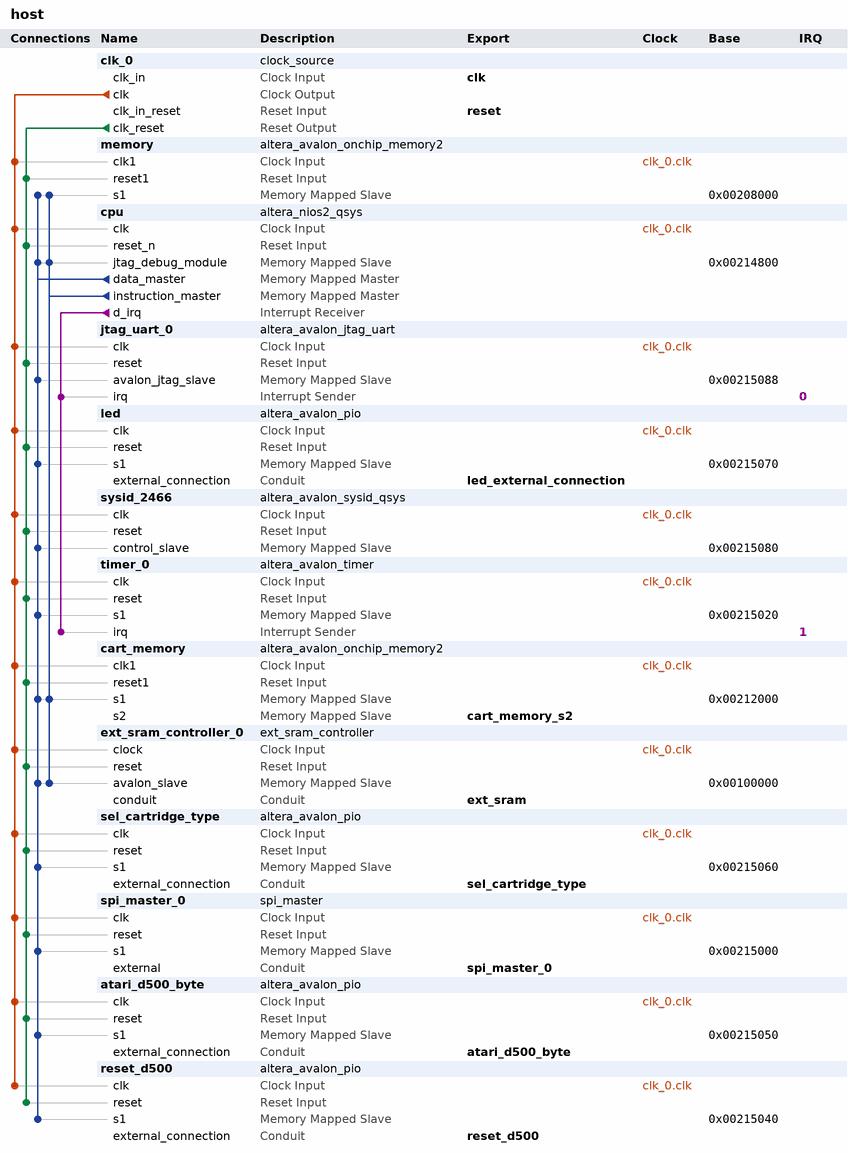
[diagram p0: system contents]
# Platform Designer (Qsys) system host, MAX 10 10M08SAE144C8GES
# Parameters at their usual value, and those the tool derives, are not listed.
package require -exact qsys 14.1
create_system host
set_project_property DEVICE_FAMILY {MAX 10}
set_project_property DEVICE 10M08SAE144C8GES

add_instance clk_0 clock_source 14.1
set_instance_parameter_value clk_0 clockFrequency 50000000

add_instance memory altera_avalon_onchip_memory2 14.1
set_instance_parameter_value memory dataWidth 32
set_instance_parameter_value memory dualPort false
set_instance_parameter_value memory initMemContent true
set_instance_parameter_value memory initializationFileName onchip_mem.hex
set_instance_parameter_value memory memorySize 28672

add_instance cpu altera_nios2_qsys 14.1
set_instance_parameter_value cpu breakSlave cpu.jtag_debug_module
set_instance_parameter_value cpu exceptionSlave memory.s1
set_instance_parameter_value cpu icache_size 4096
set_instance_parameter_value cpu impl Tiny
set_instance_parameter_value cpu mmu_TLBMissExcSlave None
set_instance_parameter_value cpu muldiv_multiplierType DSPBlock
set_instance_parameter_value cpu resetSlave memory.s1
set_instance_parameter_value cpu resetrequest_enabled true

add_instance jtag_uart_0 altera_avalon_jtag_uart 14.1
set_instance_parameter_value jtag_uart_0 simInteractiveOptions NO_INTERACTIVE_WINDOWS

add_instance led altera_avalon_pio 14.1
set_instance_parameter_value led direction Output
set_instance_parameter_value led width 5

add_instance sysid_2466 altera_avalon_sysid_qsys 14.1
set_instance_parameter_value sysid_2466 id 9318

add_instance timer_0 altera_avalon_timer 14.1
set_instance_parameter_value timer_0 period 1
set_instance_parameter_value timer_0 periodUnits MSEC

add_instance cart_memory altera_avalon_onchip_memory2 14.1
set_instance_parameter_value cart_memory dataWidth 8
set_instance_parameter_value cart_memory dualPort true
set_instance_parameter_value cart_memory initMemContent true
set_instance_parameter_value cart_memory initializationFileName boot_rom.hex
set_instance_parameter_value cart_memory memorySize 8192
set_instance_parameter_value cart_memory singleClockOperation true
set_instance_parameter_value cart_memory useNonDefaultInitFile true

add_instance ext_sram_controller_0 ext_sram_controller 1.0

add_instance sel_cartridge_type altera_avalon_pio 14.1
set_instance_parameter_value sel_cartridge_type direction Output
set_instance_parameter_value sel_cartridge_type width 8

add_instance spi_master_0 spi_master 1.3

add_instance atari_d500_byte altera_avalon_pio 14.1
set_instance_parameter_value atari_d500_byte direction Input
set_instance_parameter_value atari_d500_byte width 8

add_instance reset_d500 altera_avalon_pio 14.1
set_instance_parameter_value reset_d500 direction Output
set_instance_parameter_value reset_d500 width 1

# connections
add_connection clk_0.clk atari_d500_byte.clk clock
add_connection clk_0.clk cart_memory.clk1 clock
add_connection clk_0.clk cpu.clk clock
add_connection clk_0.clk ext_sram_controller_0.clock clock
add_connection clk_0.clk jtag_uart_0.clk clock
add_connection clk_0.clk led.clk clock
add_connection clk_0.clk memory.clk1 clock
add_connection clk_0.clk reset_d500.clk clock
add_connection clk_0.clk sel_cartridge_type.clk clock
add_connection clk_0.clk spi_master_0.clk clock
add_connection clk_0.clk sysid_2466.clk clock
add_connection clk_0.clk timer_0.clk clock
add_connection clk_0.clk_reset atari_d500_byte.reset reset
add_connection clk_0.clk_reset cart_memory.reset1 reset
add_connection clk_0.clk_reset cpu.reset_n reset
add_connection clk_0.clk_reset ext_sram_controller_0.reset reset
add_connection clk_0.clk_reset jtag_uart_0.reset reset
add_connection clk_0.clk_reset led.reset reset
add_connection clk_0.clk_reset memory.reset1 reset
add_connection clk_0.clk_reset reset_d500.reset reset
add_connection clk_0.clk_reset sel_cartridge_type.reset reset
add_connection clk_0.clk_reset spi_master_0.reset reset
add_connection clk_0.clk_reset sysid_2466.reset reset
add_connection clk_0.clk_reset timer_0.reset reset
add_connection cpu.data_master atari_d500_byte.s1 avalon
set_connection_parameter_value cpu.data_master/atari_d500_byte.s1 baseAddress 0x00215050
add_connection cpu.data_master cart_memory.s1 avalon
set_connection_parameter_value cpu.data_master/cart_memory.s1 baseAddress 0x00212000
add_connection cpu.data_master cpu.jtag_debug_module avalon
set_connection_parameter_value cpu.data_master/cpu.jtag_debug_module baseAddress 0x00214800
add_connection cpu.data_master ext_sram_controller_0.avalon_slave avalon
set_connection_parameter_value cpu.data_master/ext_sram_controller_0.avalon_slave baseAddress 0x00100000
add_connection cpu.data_master jtag_uart_0.avalon_jtag_slave avalon
set_connection_parameter_value cpu.data_master/jtag_uart_0.avalon_jtag_slave baseAddress 0x00215088
add_connection cpu.data_master led.s1 avalon
set_connection_parameter_value cpu.data_master/led.s1 baseAddress 0x00215070
add_connection cpu.data_master memory.s1 avalon
set_connection_parameter_value cpu.data_master/memory.s1 baseAddress 0x00208000
add_connection cpu.data_master reset_d500.s1 avalon
set_connection_parameter_value cpu.data_master/reset_d500.s1 baseAddress 0x00215040
add_connection cpu.data_master sel_cartridge_type.s1 avalon
set_connection_parameter_value cpu.data_master/sel_cartridge_type.s1 baseAddress 0x00215060
add_connection cpu.data_master spi_master_0.s1 avalon
set_connection_parameter_value cpu.data_master/spi_master_0.s1 baseAddress 0x00215000
add_connection cpu.data_master sysid_2466.control_slave avalon
set_connection_parameter_value cpu.data_master/sysid_2466.control_slave baseAddress 0x00215080
add_connection cpu.data_master timer_0.s1 avalon
set_connection_parameter_value cpu.data_master/timer_0.s1 baseAddress 0x00215020
add_connection cpu.instruction_master cart_memory.s1 avalon
set_connection_parameter_value cpu.instruction_master/cart_memory.s1 baseAddress 0x00212000
add_connection cpu.instruction_master cpu.jtag_debug_module avalon
set_connection_parameter_value cpu.instruction_master/cpu.jtag_debug_module baseAddress 0x00214800
add_connection cpu.instruction_master ext_sram_controller_0.avalon_slave avalon
set_connection_parameter_value cpu.instruction_master/ext_sram_controller_0.avalon_slave baseAddress 0x00100000
add_connection cpu.instruction_master memory.s1 avalon
set_connection_parameter_value cpu.instruction_master/memory.s1 baseAddress 0x00208000
add_connection cpu.d_irq jtag_uart_0.irq interrupt
set_connection_parameter_value cpu.d_irq/jtag_uart_0.irq irqNumber 0
add_connection cpu.d_irq timer_0.irq interrupt
set_connection_parameter_value cpu.d_irq/timer_0.irq irqNumber 1

# exported interfaces
add_interface atari_d500_byte conduit end
set_interface_property atari_d500_byte EXPORT_OF atari_d500_byte.external_connection
add_interface cart_memory_s2 avalon slave
set_interface_property cart_memory_s2 EXPORT_OF cart_memory.s2
add_interface clk clock sink
set_interface_property clk EXPORT_OF clk_0.clk_in
add_interface ext_sram conduit end
set_interface_property ext_sram EXPORT_OF ext_sram_controller_0.conduit
add_interface led_external_connection conduit end
set_interface_property led_external_connection EXPORT_OF led.external_connection
add_interface reset reset sink
set_interface_property reset EXPORT_OF clk_0.clk_in_reset
add_interface reset_d500 conduit end
set_interface_property reset_d500 EXPORT_OF reset_d500.external_connection
add_interface sel_cartridge_type conduit end
set_interface_property sel_cartridge_type EXPORT_OF sel_cartridge_type.external_connection
add_interface spi_master_0 conduit end
set_interface_property spi_master_0 EXPORT_OF spi_master_0.external

set_interconnect_requirement {$system} qsys_mm.clockCrossingAdapter HANDSHAKE
set_interconnect_requirement {$system} qsys_mm.insertDefaultSlave FALSE
set_interconnect_requirement {$system} qsys_mm.maxAdditionalLatency 1

save_system host.qsys
